# Altium schematic sheet Cpcis_connectors_P4_P5_P6.SchDoc: DI/OT System Board
size 420 x 297 mm; CheckedBy: P. Kulik, G. Daniluk; CompanyName: Creotech Instruments SA; DrawnBy: G.Kasprowicz; Organization: CERN; Address1: European Organization for Nuclear Research; Address2: CH-1211 Geneve 23 - Switzerland; DocumentNumber: 21; Revision: 3; SheetNumber: 21; SheetTotal: 29; EDA_Number: EDA-04514-V3-0; Projet: DI/OT System Board; ModifiedBy: F. Świtakowski; CreateDate: 1.10.2019; CheckedDate: 10.11.2019; Title2: CPCIS Connectors P4-P6; DivGrp: BE-CO; Designer: G.Kasprowicz; DocumentName: AFPGA_power.SchDoc; ModifiedDate: -; Rule: PcbType=ProtelPcb
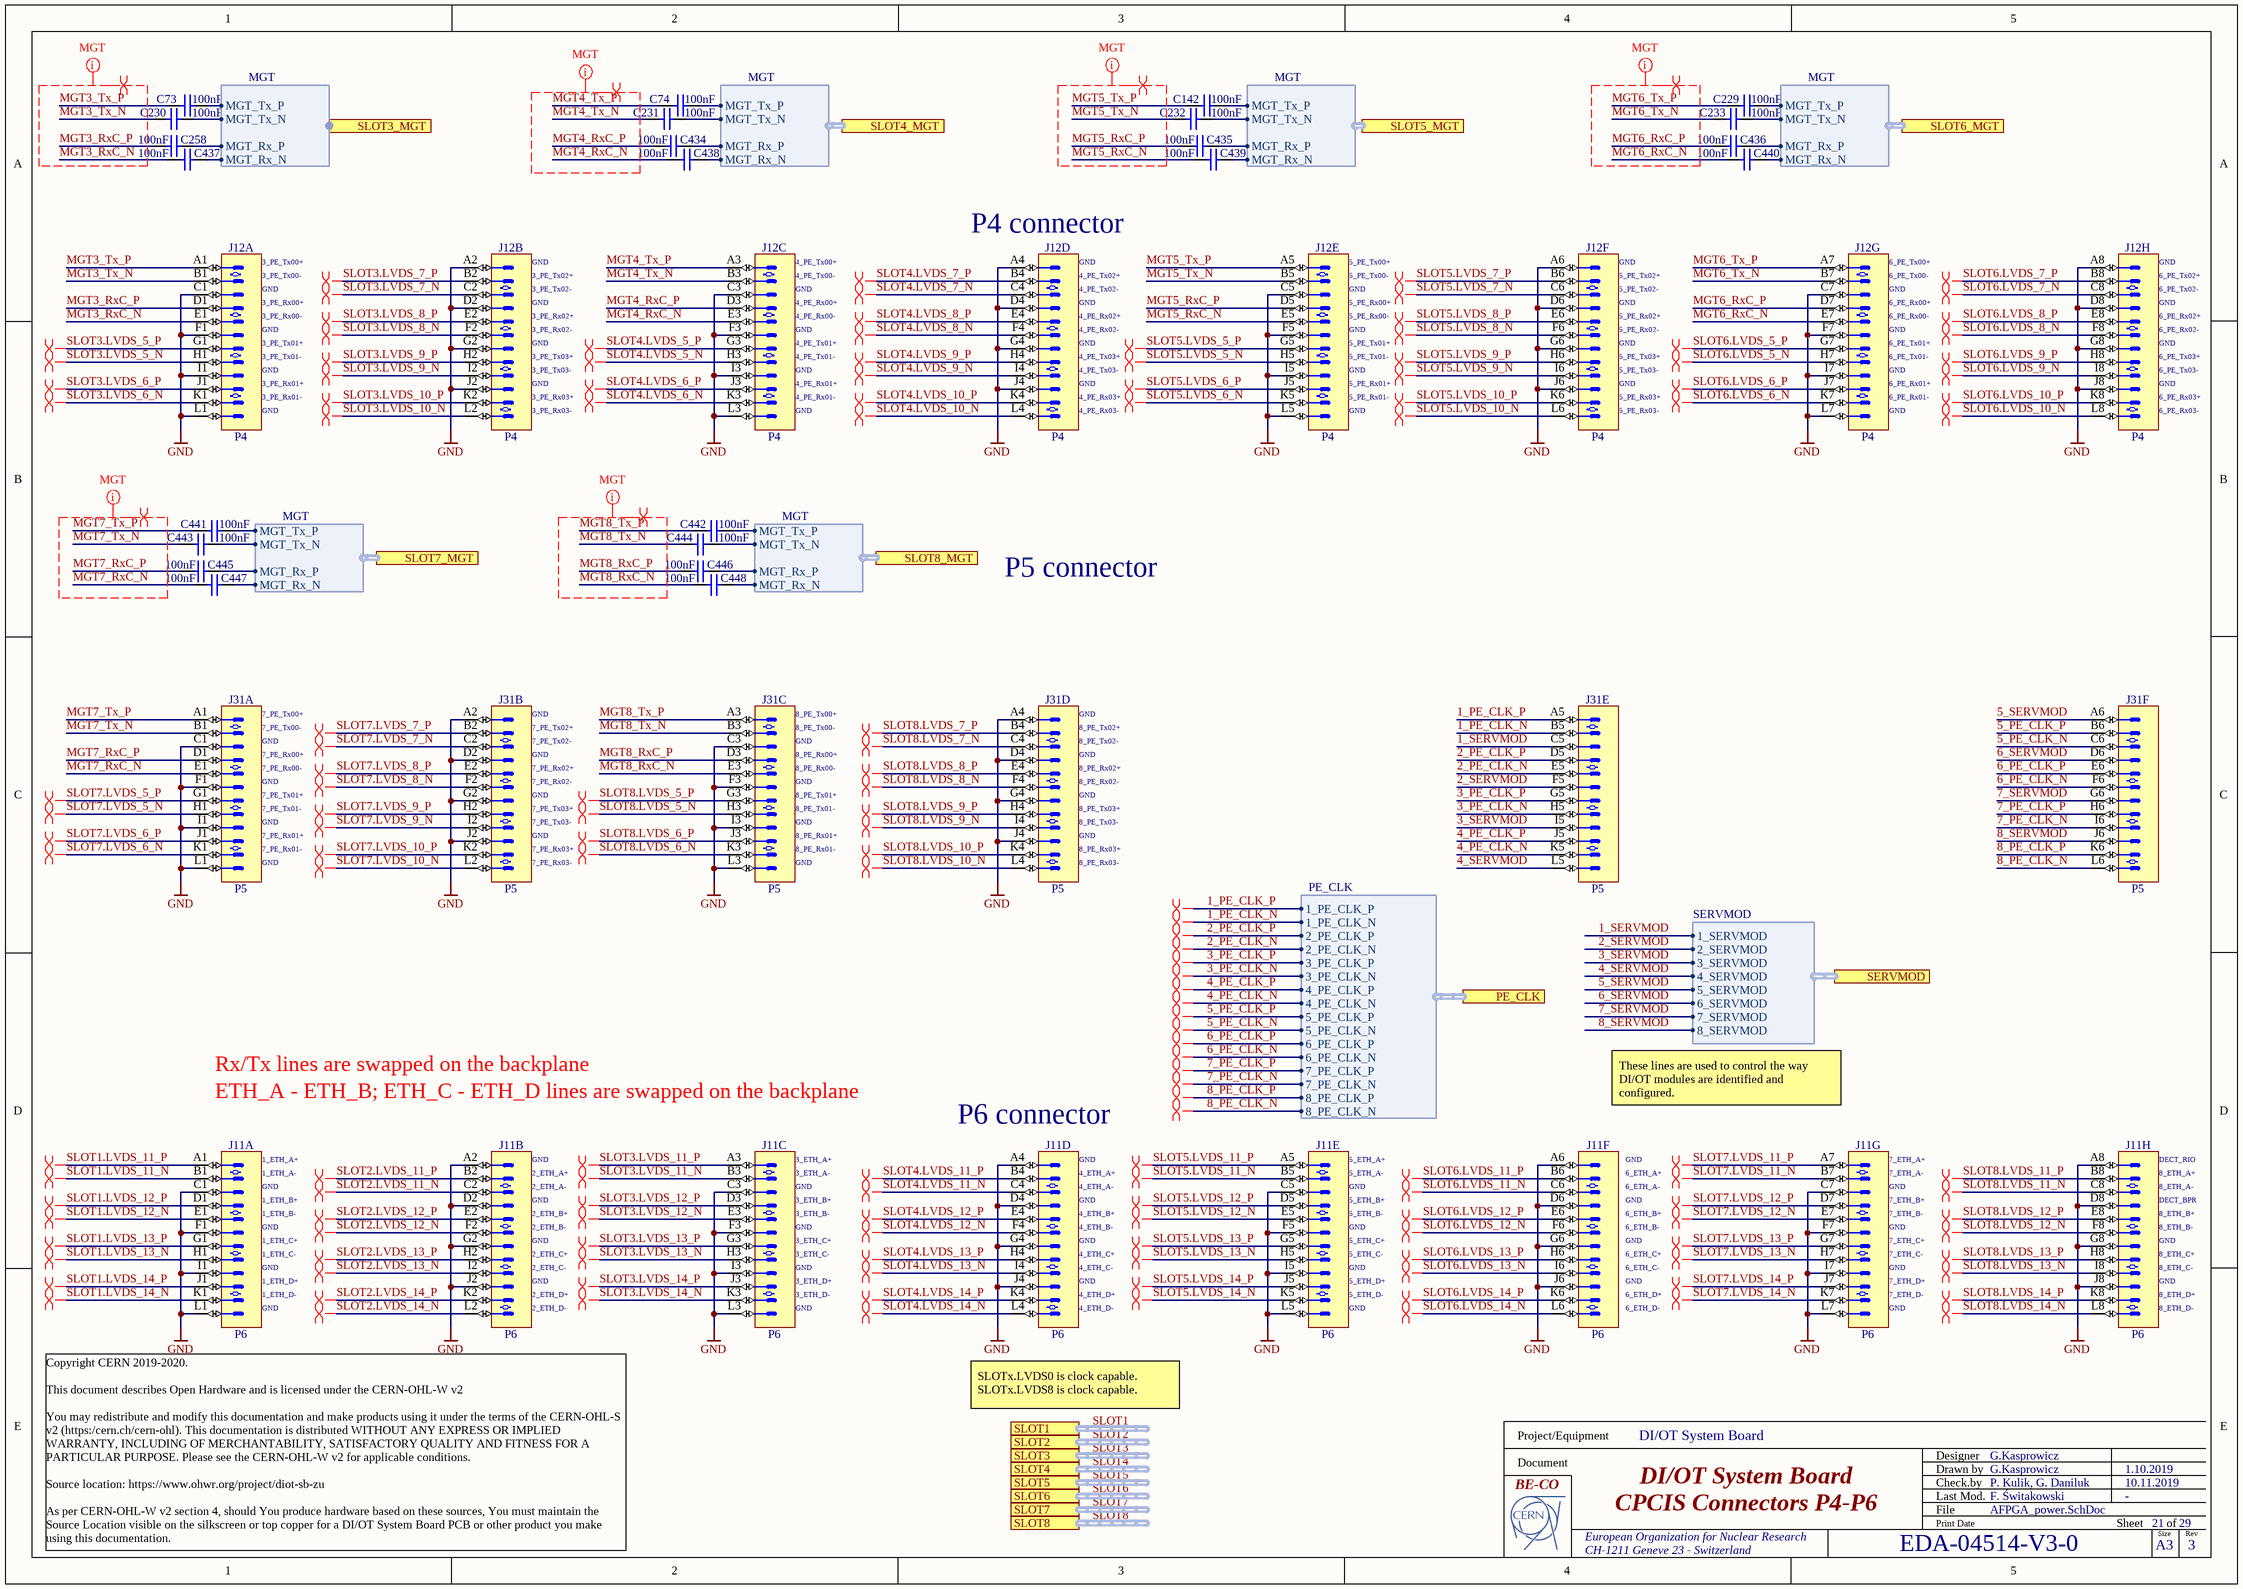
[diagram p0: Cpcis_connectors_P4_P5_P6.SchDoc]

## Parts
C73  100nF  [CAPC0603X33N]
C74  100nF  [CAPC0603X33N]
C142  100nF  [CAPC0603X33N]
C229  100nF  [CAPC0603X33N]
C230  100nF  [CAPC0603X33N]
C231  100nF  [CAPC0603X33N]
C232  100nF  [CAPC0603X33N]
C233  100nF  [CAPC0603X33N]
C258  100nF  [CAPC0603X33N]
C434  100nF  [CAPC0603X33N]
C435  100nF  [CAPC0603X33N]
C436  100nF  [CAPC0603X33N]
C437  100nF  [CAPC0603X33N]
C438  100nF  [CAPC0603X33N]
C439  100nF  [CAPC0603X33N]
C440  100nF  [CAPC0603X33N]
C441  100nF  [CAPC0603X33N]
C442  100nF  [CAPC0603X33N]
C443  100nF  [CAPC0603X33N]
C444  100nF  [CAPC0603X33N]
C445  100nF  [CAPC0603X33N]
C446  100nF  [CAPC0603X33N]
C447  100nF  [CAPC0603X33N]
C448  100nF  [CAPC0603X33N]
J11  P6  [AMPHENOL_10052838-101LF]  (parts A,B,C,D,E,F,G,H of 8)
J12  P4  [AMPHENOL_10052837-101LF]  (parts A,B,C,D,E,F,G,H of 8)
J31  P5  [AMPHENOL_10052824-101LF]  (parts A,B,C,D,E,F of 6)

## Ports
PE_CLK (harness PE_CLK), SERVMOD (harness SERVMOD), SLOT1 (harness SLOT), SLOT2 (harness SLOT), SLOT3 (harness SLOT), SLOT3_MGT (harness MGT), SLOT4 (harness SLOT), SLOT4_MGT (harness MGT), SLOT5 (harness SLOT), SLOT5_MGT (harness MGT), SLOT6 (harness SLOT), SLOT6_MGT (harness MGT), SLOT7 (harness SLOT), SLOT7_MGT (harness MGT), SLOT8 (harness SLOT), SLOT8_MGT (harness MGT)

## Harnesses
MGT: MGT_Tx_P, MGT_Tx_N, MGT_Rx_P, MGT_Rx_N
SERVMOD: 5_SERVMOD, 6_SERVMOD, 2_SERVMOD, 7_SERVMOD, 3_SERVMOD, 4_SERVMOD, 1_SERVMOD, 8_SERVMOD
PE_CLK: 1_PE_CLK_P, 1_PE_CLK_N, 2_PE_CLK_P, 2_PE_CLK_N, 3_PE_CLK_P, 3_PE_CLK_N, 4_PE_CLK_P, 4_PE_CLK_N, 5_PE_CLK_P, 5_PE_CLK_N, 6_PE_CLK_P, 6_PE_CLK_N, 7_PE_CLK_P, 7_PE_CLK_N, 8_PE_CLK_P, 8_PE_CLK_N

## Nets
GND: J11.A2 J11.A4 J11.A6 J11.A8 J11.C1 J11.C3 J11.C5 J11.C7 J11.D2 J11.D4 J11.D6 J11.D8 J11.F1 J11.F3 J11.F5 J11.F7 J11.G2 J11.G4 J11.G6 J11.G8 J11.I1 J11.I3 J11.I5 J11.I7 J11.J2 J11.J4 J11.J6 J11.J8 J11.L1 J11.L3 J11.L5 J11.L7 J12.A2 J12.A4 J12.A6 J12.A8 J12.C1 J12.C3 J12.C5 J12.C7 J12.D2 J12.D4 J12.D6 J12.D8 J12.F1 J12.F3 J12.F5 J12.F7 J12.G2 J12.G4 J12.G6 J12.G8 J12.I1 J12.I3 J12.I5 J12.I7 J12.J2 J12.J4 J12.J6 J12.J8 J12.L1 J12.L3 J12.L5 J12.L7 J31.A2 J31.A4 J31.C1 J31.C3 J31.D2 J31.D4 J31.F1 J31.F3 J31.G2 J31.G4 J31.I1 J31.I3 J31.J2 J31.J4 J31.L1 J31.L3
1_PE_CLK_N: J31.B5 ; port PE_CLK.1_PE_CLK_N
1_PE_CLK_P: J31.A5 ; port PE_CLK.1_PE_CLK_P
1_SERVMOD: J31.C5 ; port SERVMOD.1_SERVMOD
2_PE_CLK_N: J31.E5 ; port PE_CLK.2_PE_CLK_N
2_PE_CLK_P: J31.D5 ; port PE_CLK.2_PE_CLK_P
2_SERVMOD: J31.F5 ; port SERVMOD.2_SERVMOD
3_PE_CLK_N: J31.H5 ; port PE_CLK.3_PE_CLK_N
3_PE_CLK_P: J31.G5 ; port PE_CLK.3_PE_CLK_P
3_SERVMOD: J31.I5 ; port SERVMOD.3_SERVMOD
4_PE_CLK_N: J31.K5 ; port PE_CLK.4_PE_CLK_N
4_PE_CLK_P: J31.J5 ; port PE_CLK.4_PE_CLK_P
4_SERVMOD: J31.L5 ; port SERVMOD.4_SERVMOD
5_PE_CLK_N: J31.C6 ; port PE_CLK.5_PE_CLK_N
5_PE_CLK_P: J31.B6 ; port PE_CLK.5_PE_CLK_P
5_SERVMOD: J31.A6 ; port SERVMOD.5_SERVMOD
6_PE_CLK_N: J31.F6 ; port PE_CLK.6_PE_CLK_N
6_PE_CLK_P: J31.E6 ; port PE_CLK.6_PE_CLK_P
6_SERVMOD: J31.D6 ; port SERVMOD.6_SERVMOD
7_PE_CLK_N: J31.I6 ; port PE_CLK.7_PE_CLK_N
7_PE_CLK_P: J31.H6 ; port PE_CLK.7_PE_CLK_P
7_SERVMOD: J31.G6 ; port SERVMOD.7_SERVMOD
8_PE_CLK_N: J31.L6 ; port PE_CLK.8_PE_CLK_N
8_PE_CLK_P: J31.K6 ; port PE_CLK.8_PE_CLK_P
8_SERVMOD: J31.J6 ; port SERVMOD.8_SERVMOD
MGT3_RxC_N: C437.1 J12.E1
MGT3_RxC_P: C258.1 J12.D1
MGT3_Tx_N: C230.2 J12.B1
MGT3_Tx_P: C73.2 J12.A1
MGT4_RxC_N: C438.1 J12.E3
MGT4_RxC_P: C434.1 J12.D3
MGT4_Tx_N: C231.2 J12.B3
MGT4_Tx_P: C74.2 J12.A3
MGT5_RxC_N: C439.1 J12.E5
MGT5_RxC_P: C435.1 J12.D5
MGT5_Tx_N: C232.2 J12.B5
MGT5_Tx_P: C142.2 J12.A5
MGT6_RxC_N: C440.1 J12.E7
MGT6_RxC_P: C436.1 J12.D7
MGT6_Tx_N: C233.2 J12.B7
MGT6_Tx_P: C229.2 J12.A7
MGT7_RxC_N: C447.1 J31.E1
MGT7_RxC_P: C445.1 J31.D1
MGT7_Tx_N: C443.2 J31.B1
MGT7_Tx_P: C441.2 J31.A1
MGT8_RxC_N: C448.1 J31.E3
MGT8_RxC_P: C446.1 J31.D3
MGT8_Tx_N: C444.2 J31.B3
MGT8_Tx_P: C442.2 J31.A3
SLOT1.LVDS_11_N: J11.B1
SLOT1.LVDS_11_P: J11.A1
SLOT1.LVDS_12_N: J11.E1
SLOT1.LVDS_12_P: J11.D1
SLOT1.LVDS_13_N: J11.H1
SLOT1.LVDS_13_P: J11.G1
SLOT1.LVDS_14_N: J11.K1
SLOT1.LVDS_14_P: J11.J1
SLOT2.LVDS_11_N: J11.C2
SLOT2.LVDS_11_P: J11.B2
SLOT2.LVDS_12_N: J11.F2
SLOT2.LVDS_12_P: J11.E2
SLOT2.LVDS_13_N: J11.I2
SLOT2.LVDS_13_P: J11.H2
SLOT2.LVDS_14_N: J11.L2
SLOT2.LVDS_14_P: J11.K2
SLOT3.LVDS_5_N: J12.H1
SLOT3.LVDS_5_P: J12.G1
SLOT3.LVDS_6_N: J12.K1
SLOT3.LVDS_6_P: J12.J1
SLOT3.LVDS_7_N: J12.C2
SLOT3.LVDS_7_P: J12.B2
SLOT3.LVDS_8_N: J12.F2
SLOT3.LVDS_8_P: J12.E2
SLOT3.LVDS_9_N: J12.I2
SLOT3.LVDS_9_P: J12.H2
SLOT3.LVDS_10_N: J12.L2
SLOT3.LVDS_10_P: J12.K2
SLOT3.LVDS_11_N: J11.B3
SLOT3.LVDS_11_P: J11.A3
SLOT3.LVDS_12_N: J11.E3
SLOT3.LVDS_12_P: J11.D3
SLOT3.LVDS_13_N: J11.H3
SLOT3.LVDS_13_P: J11.G3
SLOT3.LVDS_14_N: J11.K3
SLOT3.LVDS_14_P: J11.J3
SLOT4.LVDS_5_N: J12.H3
SLOT4.LVDS_5_P: J12.G3
SLOT4.LVDS_6_N: J12.K3
SLOT4.LVDS_6_P: J12.J3
SLOT4.LVDS_7_N: J12.C4
SLOT4.LVDS_7_P: J12.B4
SLOT4.LVDS_8_N: J12.F4
SLOT4.LVDS_8_P: J12.E4
SLOT4.LVDS_9_N: J12.I4
SLOT4.LVDS_9_P: J12.H4
SLOT4.LVDS_10_N: J12.L4
SLOT4.LVDS_10_P: J12.K4
SLOT4.LVDS_11_N: J11.C4
SLOT4.LVDS_11_P: J11.B4
SLOT4.LVDS_12_N: J11.F4
SLOT4.LVDS_12_P: J11.E4
SLOT4.LVDS_13_N: J11.I4
SLOT4.LVDS_13_P: J11.H4
SLOT4.LVDS_14_N: J11.L4
SLOT4.LVDS_14_P: J11.K4
SLOT5.LVDS_5_N: J12.H5
SLOT5.LVDS_5_P: J12.G5
SLOT5.LVDS_6_N: J12.K5
SLOT5.LVDS_6_P: J12.J5
SLOT5.LVDS_7_N: J12.C6
SLOT5.LVDS_7_P: J12.B6
SLOT5.LVDS_8_N: J12.F6
SLOT5.LVDS_8_P: J12.E6
SLOT5.LVDS_9_N: J12.I6
SLOT5.LVDS_9_P: J12.H6
SLOT5.LVDS_10_N: J12.L6
SLOT5.LVDS_10_P: J12.K6
SLOT5.LVDS_11_N: J11.B5
SLOT5.LVDS_11_P: J11.A5
SLOT5.LVDS_12_N: J11.E5
SLOT5.LVDS_12_P: J11.D5
SLOT5.LVDS_13_N: J11.H5
SLOT5.LVDS_13_P: J11.G5
SLOT5.LVDS_14_N: J11.K5
SLOT5.LVDS_14_P: J11.J5
SLOT6.LVDS_5_N: J12.H7
SLOT6.LVDS_5_P: J12.G7
SLOT6.LVDS_6_N: J12.K7
SLOT6.LVDS_6_P: J12.J7
SLOT6.LVDS_7_N: J12.C8
SLOT6.LVDS_7_P: J12.B8
SLOT6.LVDS_8_N: J12.F8
SLOT6.LVDS_8_P: J12.E8
SLOT6.LVDS_9_N: J12.I8
SLOT6.LVDS_9_P: J12.H8
SLOT6.LVDS_10_N: J12.L8
SLOT6.LVDS_10_P: J12.K8
SLOT6.LVDS_11_N: J11.C6
SLOT6.LVDS_11_P: J11.B6
SLOT6.LVDS_12_N: J11.F6
SLOT6.LVDS_12_P: J11.E6
SLOT6.LVDS_13_N: J11.I6
SLOT6.LVDS_13_P: J11.H6
SLOT6.LVDS_14_N: J11.L6
SLOT6.LVDS_14_P: J11.K6
SLOT7.LVDS_5_N: J31.H1
SLOT7.LVDS_5_P: J31.G1
SLOT7.LVDS_6_N: J31.K1
SLOT7.LVDS_6_P: J31.J1
SLOT7.LVDS_7_N: J31.C2
SLOT7.LVDS_7_P: J31.B2
SLOT7.LVDS_8_N: J31.F2
SLOT7.LVDS_8_P: J31.E2
SLOT7.LVDS_9_N: J31.I2
SLOT7.LVDS_9_P: J31.H2
SLOT7.LVDS_10_N: J31.L2
SLOT7.LVDS_10_P: J31.K2
SLOT7.LVDS_11_N: J11.B7
SLOT7.LVDS_11_P: J11.A7
SLOT7.LVDS_12_N: J11.E7
SLOT7.LVDS_12_P: J11.D7
SLOT7.LVDS_13_N: J11.H7
SLOT7.LVDS_13_P: J11.G7
SLOT7.LVDS_14_N: J11.K7
SLOT7.LVDS_14_P: J11.J7
SLOT8.LVDS_5_N: J31.H3
SLOT8.LVDS_5_P: J31.G3
SLOT8.LVDS_6_N: J31.K3
SLOT8.LVDS_6_P: J31.J3
SLOT8.LVDS_7_N: J31.C4
SLOT8.LVDS_7_P: J31.B4
SLOT8.LVDS_8_N: J31.F4
SLOT8.LVDS_8_P: J31.E4
SLOT8.LVDS_9_N: J31.I4
SLOT8.LVDS_9_P: J31.H4
SLOT8.LVDS_10_N: J31.L4
SLOT8.LVDS_10_P: J31.K4
SLOT8.LVDS_11_N: J11.C8
SLOT8.LVDS_11_P: J11.B8
SLOT8.LVDS_12_N: J11.F8
SLOT8.LVDS_12_P: J11.E8
SLOT8.LVDS_13_N: J11.I8
SLOT8.LVDS_13_P: J11.H8
SLOT8.LVDS_14_N: J11.L8
SLOT8.LVDS_14_P: J11.K8
NetC73_1: C73.1 ; port SLOT3_MGT.MGT_Tx_P
NetC74_1: C74.1 ; port SLOT4_MGT.MGT_Tx_P
NetC142_1: C142.1 ; port SLOT5_MGT.MGT_Tx_P
NetC229_1: C229.1 ; port SLOT6_MGT.MGT_Tx_P
NetC230_1: C230.1 ; port SLOT3_MGT.MGT_Tx_N
NetC231_1: C231.1 ; port SLOT4_MGT.MGT_Tx_N
NetC232_1: C232.1 ; port SLOT5_MGT.MGT_Tx_N
NetC233_1: C233.1 ; port SLOT6_MGT.MGT_Tx_N
NetC258_2: C258.2 ; port SLOT3_MGT.MGT_Rx_P
NetC434_2: C434.2 ; port SLOT4_MGT.MGT_Rx_P
NetC435_2: C435.2 ; port SLOT5_MGT.MGT_Rx_P
NetC436_2: C436.2 ; port SLOT6_MGT.MGT_Rx_P
NetC437_2: C437.2 ; port SLOT3_MGT.MGT_Rx_N
NetC438_2: C438.2 ; port SLOT4_MGT.MGT_Rx_N
NetC439_2: C439.2 ; port SLOT5_MGT.MGT_Rx_N
NetC440_2: C440.2 ; port SLOT6_MGT.MGT_Rx_N
NetC441_1: C441.1 ; port SLOT7_MGT.MGT_Tx_P
NetC442_1: C442.1 ; port SLOT8_MGT.MGT_Tx_P
NetC443_1: C443.1 ; port SLOT7_MGT.MGT_Tx_N
NetC444_1: C444.1 ; port SLOT8_MGT.MGT_Tx_N
NetC445_2: C445.2 ; port SLOT7_MGT.MGT_Rx_P
NetC446_2: C446.2 ; port SLOT8_MGT.MGT_Rx_P
NetC447_2: C447.2 ; port SLOT7_MGT.MGT_Rx_N
NetC448_2: C448.2 ; port SLOT8_MGT.MGT_Rx_N

## Buses and harness runs
harness SLOT1 = port SLOT1
harness SLOT2 = port SLOT2
harness SLOT3 = port SLOT3
harness SLOT4 = port SLOT4
harness SLOT5 = port SLOT5
harness SLOT6 = port SLOT6
harness SLOT7 = port SLOT7
harness SLOT8 = port SLOT8

## Layout directives
differential pair: 1_PE_CLK_N, 1_PE_CLK_P, 2_PE_CLK_N, 2_PE_CLK_P, 3_PE_CLK_N, 3_PE_CLK_P, 4_PE_CLK_N, 4_PE_CLK_P, 5_PE_CLK_N, 5_PE_CLK_P, 6_PE_CLK_N, 6_PE_CLK_P, 7_PE_CLK_N, 7_PE_CLK_P, 8_PE_CLK_N, 8_PE_CLK_P, MGT3_RxC_N, MGT3_RxC_P, MGT3_Tx_N, MGT3_Tx_P, MGT4_RxC_N, MGT4_RxC_P, MGT4_Tx_N, MGT4_Tx_P, MGT5_RxC_N, MGT5_RxC_P, MGT5_Tx_N, MGT5_Tx_P, MGT6_RxC_N, MGT6_RxC_P, MGT6_Tx_N, MGT6_Tx_P, MGT7_RxC_N, MGT7_RxC_P, MGT7_Tx_N, MGT7_Tx_P, MGT8_RxC_N, MGT8_RxC_P, MGT8_Tx_N, MGT8_Tx_P, SLOT1.LVDS_11_N, SLOT1.LVDS_11_P, SLOT1.LVDS_12_N, SLOT1.LVDS_12_P, SLOT1.LVDS_13_N, SLOT1.LVDS_13_P, SLOT1.LVDS_14_N, SLOT1.LVDS_14_P, SLOT2.LVDS_11_N, SLOT2.LVDS_11_P, SLOT2.LVDS_12_N, SLOT2.LVDS_12_P, SLOT2.LVDS_13_N, SLOT2.LVDS_13_P, SLOT2.LVDS_14_N, SLOT2.LVDS_14_P, SLOT3.LVDS_5_N, SLOT3.LVDS_5_P, SLOT3.LVDS_6_N, SLOT3.LVDS_6_P, SLOT3.LVDS_7_N, SLOT3.LVDS_7_P, SLOT3.LVDS_8_N, SLOT3.LVDS_8_P, SLOT3.LVDS_9_N, SLOT3.LVDS_9_P, SLOT3.LVDS_10_N, SLOT3.LVDS_10_P, SLOT3.LVDS_11_N, SLOT3.LVDS_11_P, SLOT3.LVDS_12_N, SLOT3.LVDS_12_P, SLOT3.LVDS_13_N, SLOT3.LVDS_13_P, SLOT3.LVDS_14_N, SLOT3.LVDS_14_P, SLOT4.LVDS_5_N, SLOT4.LVDS_5_P, SLOT4.LVDS_6_N, SLOT4.LVDS_6_P, SLOT4.LVDS_7_N, SLOT4.LVDS_7_P, SLOT4.LVDS_8_N, SLOT4.LVDS_8_P, SLOT4.LVDS_9_N, SLOT4.LVDS_9_P, SLOT4.LVDS_10_N, SLOT4.LVDS_10_P, SLOT4.LVDS_11_N, SLOT4.LVDS_11_P, SLOT4.LVDS_12_N, SLOT4.LVDS_12_P, SLOT4.LVDS_13_N, SLOT4.LVDS_13_P, SLOT4.LVDS_14_N, SLOT4.LVDS_14_P, SLOT5.LVDS_5_N, SLOT5.LVDS_5_P, SLOT5.LVDS_6_N, SLOT5.LVDS_6_P, SLOT5.LVDS_7_N, SLOT5.LVDS_7_P, SLOT5.LVDS_8_N, SLOT5.LVDS_8_P, SLOT5.LVDS_9_N, SLOT5.LVDS_9_P, SLOT5.LVDS_10_N, SLOT5.LVDS_10_P, SLOT5.LVDS_11_N, SLOT5.LVDS_11_P, SLOT5.LVDS_12_N, SLOT5.LVDS_12_P, SLOT5.LVDS_13_N, SLOT5.LVDS_13_P, SLOT5.LVDS_14_N, SLOT5.LVDS_14_P, SLOT6.LVDS_5_N, SLOT6.LVDS_5_P, SLOT6.LVDS_6_N, SLOT6.LVDS_6_P, SLOT6.LVDS_7_N, SLOT6.LVDS_7_P, SLOT6.LVDS_8_N, SLOT6.LVDS_8_P, SLOT6.LVDS_9_N, SLOT6.LVDS_9_P, SLOT6.LVDS_10_N, SLOT6.LVDS_10_P, SLOT6.LVDS_11_N, SLOT6.LVDS_11_P, SLOT6.LVDS_12_N, SLOT6.LVDS_12_P, SLOT6.LVDS_13_N, SLOT6.LVDS_13_P, SLOT6.LVDS_14_N, SLOT6.LVDS_14_P, SLOT7.LVDS_5_N, SLOT7.LVDS_5_P, SLOT7.LVDS_6_N, SLOT7.LVDS_6_P, SLOT7.LVDS_7_N, SLOT7.LVDS_7_P, SLOT7.LVDS_8_N, SLOT7.LVDS_8_P, SLOT7.LVDS_9_N, SLOT7.LVDS_9_P, SLOT7.LVDS_10_N, SLOT7.LVDS_10_P, SLOT7.LVDS_11_N, SLOT7.LVDS_11_P, SLOT7.LVDS_12_N, SLOT7.LVDS_12_P, SLOT7.LVDS_13_N, SLOT7.LVDS_13_P, SLOT7.LVDS_14_N, SLOT7.LVDS_14_P, SLOT8.LVDS_5_N, SLOT8.LVDS_5_P, SLOT8.LVDS_6_N, SLOT8.LVDS_6_P, SLOT8.LVDS_7_N, SLOT8.LVDS_7_P, SLOT8.LVDS_8_N, SLOT8.LVDS_8_P, SLOT8.LVDS_9_N, SLOT8.LVDS_9_P, SLOT8.LVDS_10_N, SLOT8.LVDS_10_P, SLOT8.LVDS_11_N, SLOT8.LVDS_11_P, SLOT8.LVDS_12_N, SLOT8.LVDS_12_P, SLOT8.LVDS_13_N, SLOT8.LVDS_13_P, SLOT8.LVDS_14_N, SLOT8.LVDS_14_P
net class MGT: MGT3_RxC_N, MGT3_RxC_P, MGT3_Tx_N, MGT3_Tx_P, MGT4_RxC_N, MGT4_RxC_P, MGT4_Tx_N, MGT4_Tx_P, MGT5_RxC_N, MGT5_RxC_P, MGT5_Tx_N, MGT5_Tx_P, MGT6_RxC_N, MGT6_RxC_P, MGT6_Tx_N, MGT6_Tx_P, MGT7_RxC_N, MGT7_RxC_P, MGT7_Tx_N, MGT7_Tx_P, MGT8_RxC_N, MGT8_RxC_P, MGT8_Tx_N, MGT8_Tx_P

## Notes on the sheet
- (near J12) 3_PE_Tx00+
- (near J12) GND
- (near J12) 4_PE_Tx00+
- (near J12) P4 connector
- (near J12) 5_PE_Tx00+
- (near J12) 6_PE_Tx00+
- (near J12) 3_PE_Tx00-
- (near J12) 3_PE_Rx00+
- (near J12) 3_PE_Rx00-
- (near J12) 3_PE_Tx02+
- (near J12) 3_PE_Tx02-
- (near J12) 3_PE_Rx02+
- (near J12) 4_PE_Tx00-
- (near J12) 4_PE_Rx00+
- (near J12) 4_PE_Rx00-
- (near J12) 4_PE_Tx02+
- (near J12) 4_PE_Tx02-
- (near J12) 4_PE_Rx02+
- (near J12) 5_PE_Tx00-
- (near J12) 5_PE_Rx00+
- (near J12) 5_PE_Rx00-
- (near J12) 5_PE_Tx02+
- (near J12) 5_PE_Tx02-
- (near J12) 5_PE_Rx02+
- (near J12) 6_PE_Tx00-
- (near J12) 6_PE_Rx00+
- (near J12) 6_PE_Rx00-
- (near J12) 6_PE_Tx02+
- (near J12) 6_PE_Tx02-
- (near J12) 6_PE_Rx02+
- (near J12) 3_PE_Tx01+
- (near J12) 3_PE_Tx01-
- (near J12) 3_PE_Rx01+
- (near J12) 3_PE_Rx01-
- (near J12) 3_PE_Rx02-
- (near J12) 3_PE_Tx03+
- (near J12) 3_PE_Tx03-
- (near J12) 3_PE_Rx03+
- (near J12) 4_PE_Tx01+
- (near J12) 4_PE_Tx01-
- (near J12) 4_PE_Rx01+
- (near J12) 4_PE_Rx01-
- (near J12) 4_PE_Rx02-
- (near J12) 4_PE_Tx03+
- (near J12) 4_PE_Tx03-
- (near J12) 4_PE_Rx03+
- (near J12) 5_PE_Tx01+
- (near J12) 5_PE_Tx01-
- (near J12) 5_PE_Rx01+
- (near J12) 5_PE_Rx01-
- (near J12) 5_PE_Rx02-
- (near J12) 5_PE_Tx03+
- (near J12) 5_PE_Tx03-
- (near J12) 5_PE_Rx03+
- (near J12) 6_PE_Tx01+
- (near J12) 6_PE_Tx01-
- (near J12) 6_PE_Rx01+
- (near J12) 6_PE_Rx01-
- (near J12) 6_PE_Rx02-
- (near J12) 6_PE_Tx03+
- (near J12) 6_PE_Tx03-
- (near J12) 6_PE_Rx03+
- (near J12) 3_PE_Rx03-
- (near J12) 4_PE_Rx03-
- (near J12) 5_PE_Rx03-
- (near J12) 6_PE_Rx03-
- P5 connector
- (near J31) 7_PE_Tx00+
- (near J31) 7_PE_Tx00-
- (near J31) GND
- (near J31) 7_PE_Tx02+
- (near J31) 8_PE_Tx00+
- (near J31) 8_PE_Tx00-
- (near J31) 8_PE_Tx02+
- (near J31) 7_PE_Tx01+
- (near J31) 7_PE_Rx00+
- (near J31) 7_PE_Rx00-
- (near J31) 7_PE_Tx02-
- (near J31) 7_PE_Rx02+
- (near J31) 7_PE_Rx02-
- (near J31) 8_PE_Tx01+
- (near J31) 8_PE_Rx00+
- (near J31) 8_PE_Rx00-
- (near J31) 8_PE_Tx02-
- (near J31) 8_PE_Rx02+
- (near J31) 8_PE_Rx02-
- (near J31) 7_PE_Tx01-
- (near J31) 7_PE_Rx01+
- (near J31) 7_PE_Rx01-
- (near J31) 7_PE_Tx03+
- (near J31) 7_PE_Tx03-
- (near J31) 7_PE_Rx03+
- (near J31) 7_PE_Rx03-
- (near J31) 8_PE_Tx01-
- (near J31) 8_PE_Rx01+
- (near J31) 8_PE_Rx01-
- (near J31) 8_PE_Tx03+
- (near J31) 8_PE_Tx03-
- (near J31) 8_PE_Rx03+
- (near J31) 8_PE_Rx03-
- Rx/Tx lines are swapped on the backplane
- ETH_A - ETH_B; ETH_C - ETH_D lines are swapped on the backplane
- (near J11) P6 connector
- These lines are used to control the way DI/OT modules are identified and configured.
- (near J11) 1_ETH_A+
- (near J11) 1_ETH_A-
- (near J11) GND
- (near J11) 1_ETH_B+
- (near J11) 2_ETH_A+
- (near J11) 2_ETH_A-
- (near J11) 3_ETH_A+
- (near J11) 3_ETH_A-
- (near J11) 3_ETH_B+
- (near J11) 4_ETH_A+
- (near J11) 4_ETH_A-
- (near J11) 5_ETH_A+
- (near J11) 5_ETH_A-
- (near J11) 5_ETH_B+
- (near J11) 6_ETH_A+
- (near J11) 6_ETH_A-
- (near J11) 7_ETH_A+
- (near J11) 7_ETH_A-
- (near J11) 7_ETH_B+
- (near J11) DECT_RIO
- (near J11) 8_ETH_A+
- (near J11) 8_ETH_A-
- (near J11) DECT_BPR
- (near J11) 1_ETH_B-
- (near J11) 1_ETH_C+
- (near J11) 1_ETH_C-
- (near J11) 2_ETH_B+
- (near J11) 2_ETH_B-
- (near J11) 2_ETH_C+
- (near J11) 2_ETH_C-
- (near J11) 3_ETH_B-
- (near J11) 3_ETH_C+
- (near J11) 3_ETH_C-
- (near J11) 4_ETH_B+
- (near J11) 4_ETH_B-
- (near J11) 4_ETH_C+
- (near J11) 4_ETH_C-
- (near J11) 5_ETH_B-
- (near J11) 5_ETH_C+
- (near J11) 5_ETH_C-
- (near J11) 6_ETH_B+
- (near J11) 6_ETH_B-
- (near J11) 6_ETH_C+
- (near J11) 6_ETH_C-
- (near J11) 7_ETH_B-
- (near J11) 7_ETH_C+
- (near J11) 7_ETH_C-
- (near J11) 8_ETH_B+
- (near J11) 8_ETH_B-
- (near J11) 8_ETH_C+
- (near J11) 8_ETH_C-
- (near J11) 1_ETH_D+
- (near J11) 1_ETH_D-
- (near J11) 2_ETH_D+
- (near J11) 2_ETH_D-
- (near J11) 3_ETH_D+
- (near J11) 3_ETH_D-
- (near J11) 4_ETH_D+
- (near J11) 4_ETH_D-
- (near J11) 5_ETH_D+
- (near J11) 5_ETH_D-
- (near J11) 6_ETH_D+
- (near J11) 6_ETH_D-
- (near J11) 7_ETH_D+
- (near J11) 7_ETH_D-
- (near J11) 8_ETH_D+
- (near J11) 8_ETH_D-
- (near J11) SLOTx.LVDS0 is clock capable.
  SLOTx.LVDS8 is clock capable.
- (near J11) Copyright CERN 2019-2020.
  This document describes Open Hardware and is licensed under the CERN-OHL-W v2
  You may redistribute and modify this documentation and make products using it under the terms of the CERN-OHL-S v2 (https:/cern.ch/cern-ohl). This documentation is distributed WITHOUT ANY EXPRESS OR IMPLIED WARRANTY, INCLUDING OF MERCHANTABILITY, SATISFACTORY QUALITY AND FITNESS FOR A PARTICULAR PURPOSE. Please see the CERN-OHL-W v2 for applicable conditions.
  Source location: https://www.ohwr.org/project/diot-sb-zu
  As per CERN-OHL-W v2 section 4, should You produce hardware based on these sources, You must maintain the Source Location visible on the silkscreen or top copper for a DI/OT System Board PCB or other product you make using this documentation.
- Project/Equipment
- Document
- Designer
- Drawn by
- Check.by
- File
- Last Mod.
- Print Date
- Sheet
- Size
- A3
- of
- Rev

## Library data of the parts
C73 C74 C142 C229-C233 C258 C434-C448 = CC0201_100NF_6.3V_10%_X5R: Non-polarised capacitor; Part Description: SMD Multilayer Chip Ceramic Capacitor; Manufacturer: GENERIC; Manufacturer1 Part Number: 02016D104KAT2A; Voltage: 6.3V; TC: X5R; Tolerance: ±10%; Part Number: CC0201_100NF_6.3V_10%_X5R; Component Kind: Standard; Component Type: Standard; Pin Count: 2; Value: 100nF; Status: Not Recommended; Manufacturer Part Number: CC0201_100NF_6.3V_10%_X5R; Case: 0201; Mounted: Yes; Socket: No; SMD: Yes; Sense: No; Manufacturer1 Example: AVX; Manufacturer1 ComponentHeight: 0.33mm; HelpURL: \\cern.ch\dfs\Applications\Altium\Datasheets\CC0201_X5R_AVX.pdf; Author: CERN DEM JLC; CreateDate: 03.12.2007; LatestRevisionDate: 03.12.2007
J11 = AMPHENOL_10052838-101LF: 96 Contacts Header, 8 Columns, 4 Pairs per Column; Part Description: 96 Contacts, 2mm Pitch, 8 Columns, 4 Pairs per Column, 4 Walls, Right Angle Header; Part Number: AMPHENOL_10052838-101LF; Component Kind: Standard; Component Type: Standard; Pin Count: 96; Family: AirMax VS; Mounted: Yes; Socket: No; SMD: No; PressFit: Yes; Sense: No; Status: None; Manufacturer: AMPHENOL; Manufacturer Part Number: 10052838-101LF; ComponentHeight: 15.35mm; HelpURL: \\cern.ch\dfs\Applications\Altium\Datasheets\AMPHENOL_10052838-101LF.pdf; ComponentLink1URL: \\cern.ch\dfs\Applications\Altium\Datasheets\AMPHENOL_10052838-101LF_Application.pdf; ComponentLink1Description: Application; Author: CERN DEM MR; CreateDate: 19/02/2018; LatestRevisionDate: 19/02/2018; Classname: Overlapping
J12 = AMPHENOL_10052837-101LF: 96 Contacts Header, 8 Columns, 4 Pairs per Column; Part Description: 96 Contacts, 2mm Pitch, 8 Columns, 4 Pairs per Column, 2 Walls, Right Angle Header; Part Number: AMPHENOL_10052837-101LF; Component Kind: Standard; Component Type: Standard; Pin Count: 96; Family: AirMax VS; Mounted: Yes; Socket: No; SMD: No; PressFit: Yes; Sense: No; Status: None; Manufacturer: AMPHENOL; Manufacturer Part Number: 10052837-101LF; ComponentHeight: 15.35mm; HelpURL: \\cern.ch\dfs\Applications\Altium\Datasheets\AMPHENOL_10052837-101LF.pdf; ComponentLink1URL: \\cern.ch\dfs\Applications\Altium\Datasheets\AMPHENOL_10052837-101LF_Application.pdf; ComponentLink1Description: Application; Author: CERN DEM MR; CreateDate: 19/02/2018; LatestRevisionDate: 19/02/2018
J31 = AMPHENOL_10052824-101LF: 72 Contacts Header, 6 Columns, 4 Pairs per Column; Part Description: 72 Contacts, 2mm Pitch, 6 Columns, 4 Pairs per Column, 2 Walls, Right Angle Header; Part Number: AMPHENOL_10052824-101LF; Component Kind: Standard; Component Type: Standard; Pin Count: 72; Family: AirMax VS; Mounted: Yes; Socket: No; SMD: No; PressFit: Yes; Sense: No; Status: None; Manufacturer: AMPHENOL; Manufacturer Part Number: 10052824-101LF; ComponentHeight: 15.35mm; HelpURL: \\cern.ch\dfs\Applications\Altium\Datasheets\AMPHENOL_10052824-101LF.pdf; ComponentLink1URL: \\cern.ch\dfs\Applications\Altium\Datasheets\AMPHENOL_10052824-101LF_Application.pdf; ComponentLink1Description: Application; Author: CERN DEM JMW; CreateDate: 29/11/2017; LatestRevisionDate: 29/11/2017